# Altium schematic sheet Sheet2.SchDoc
size A4
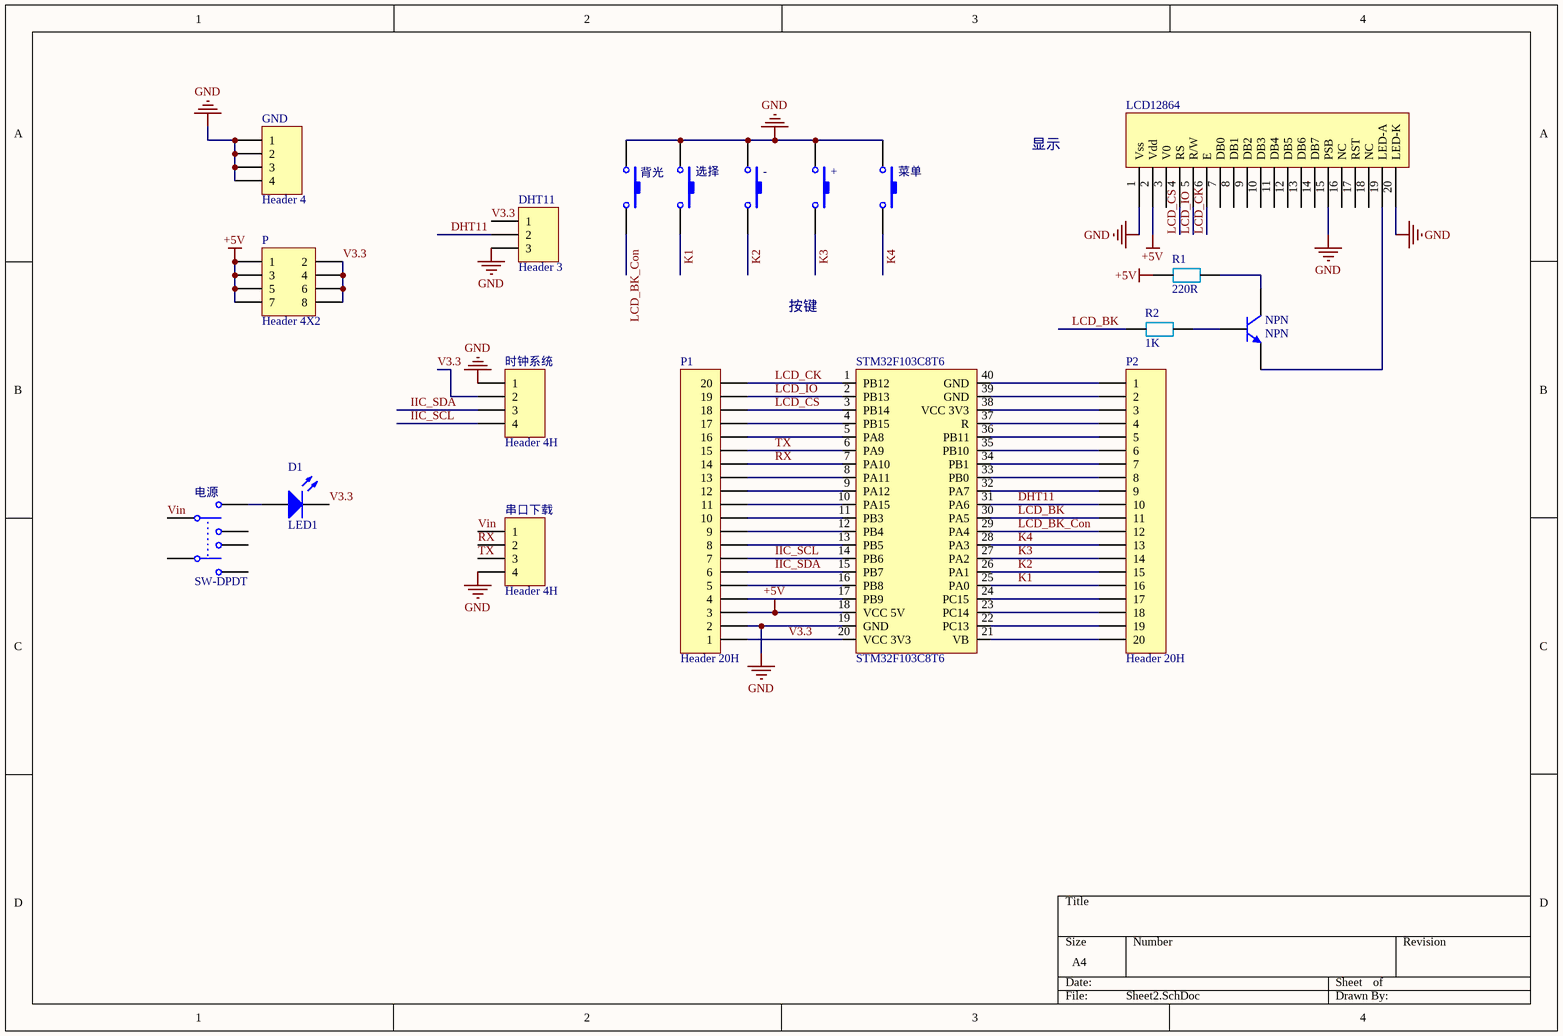
[diagram p0: Sheet2.SchDoc]

## Parts
+  SW-PB  [DPST-4]  (value not drawn)
-  SW-PB  [DPST-4]  (value not drawn)
D1  LED1  [LED-1]
DHT11  Header 3  [HDR1X3]
GND  Header 4  [HDR1X4]
LCD12864  LCD12864  [HDR1X20]  (value not drawn)
NPN  NPN  [TO-226-AA]
P  Header 4X2  [HDR2X4]
P1  Header 20H  [HDR1X20H]
P2  Header 20H  [HDR1X20H]
R1  220R  [DO-7]
R2  1K  [DO-7]
STM32F103C8T6  STM32F103C8T6  [DIP-40]
串口下载  Header 4H  [HDR1X4H]
时钟系统  Header 4H  [HDR1X4H]
电源  SW-DPDT  [DPDT-6]
背光  SW-PB  [DPST-4]  (value not drawn)
菜单  SW-PB  [DPST-4]  (value not drawn)
选择  SW-PB  [DPST-4]  (value not drawn)

## Nets
+5V: LCD12864.2(Vdd) P.1 P.3 P.5 P.7 P1.3 R1.2 STM32F103C8T6.18(VCC_5V)
GND: +.1 -.1 DHT11.3 GND.1 GND.2 GND.3 GND.4 LCD12864.1(Vss) LCD12864.15(PSB) LCD12864.20(LED-K) P1.2 STM32F103C8T6.19(GND) 串口下载.4 时钟系统.1 背光.1 菜单.1 选择.1
DHT11: DHT11.2 P2.10 STM32F103C8T6.31(PA6)
IIC_SCL: P1.7 STM32F103C8T6.14(PB6) 时钟系统.4
IIC_SDA: P1.6 STM32F103C8T6.15(PB7) 时钟系统.3
K1: P2.16 STM32F103C8T6.25(PA0) 选择.2
K2: -.2 P2.15 STM32F103C8T6.26(PA1)
K3: +.2 P2.14 STM32F103C8T6.27(PA2)
K4: P2.13 STM32F103C8T6.28(PA3) 菜单.2
LCD_BK: P2.11 R2.1 STM32F103C8T6.30(PA5)
LCD_BK_Con: P2.12 STM32F103C8T6.29(PA4) 背光.2
LCD_CK: LCD12864.6(E) P1.20 STM32F103C8T6.1(PB12)
LCD_CS: LCD12864.4(RS) P1.18 STM32F103C8T6.3(PB14)
LCD_IO: LCD12864.5(R/W) P1.19 STM32F103C8T6.2(PB13)
RX: P1.14 STM32F103C8T6.7(PA10) 串口下载.2
TX: P1.15 STM32F103C8T6.6(PA9) 串口下载.3
V3.3: D1.2(K) DHT11.1 P.2 P.4 P.6 P.8 P1.1 STM32F103C8T6.20(VCC_3V3) 时钟系统.2
Vin: 串口下载.1 电源.1
NetD1_1: D1.1(A) 电源.2
NetLCD12864_19: LCD12864.19(LED-A) NPN.3(E)
NetNPN_1: NPN.1(C) R1.1
NetNPN_2: NPN.2(B) R2.2
NetP1_4: P1.4 STM32F103C8T6.17(PB9)
NetP1_5: P1.5 STM32F103C8T6.16(PB8)
NetP1_8: P1.8 STM32F103C8T6.13(PB5)
NetP1_9: P1.9 STM32F103C8T6.12(PB4)
NetP1_10: P1.10 STM32F103C8T6.11(PB3)
NetP1_11: P1.11 STM32F103C8T6.10(PA15)
NetP1_12: P1.12 STM32F103C8T6.9(PA12)
NetP1_13: P1.13 STM32F103C8T6.8(PA11)
NetP1_16: P1.16 STM32F103C8T6.5(PA8)
NetP1_17: P1.17 STM32F103C8T6.4(PB15)
NetP2_1: P2.1 STM32F103C8T6.40(GND)
NetP2_2: P2.2 STM32F103C8T6.39(GND)
NetP2_3: P2.3 STM32F103C8T6.38(VCC_3V3)
NetP2_4: P2.4 STM32F103C8T6.37(R)
NetP2_5: P2.5 STM32F103C8T6.36(PB11)
NetP2_6: P2.6 STM32F103C8T6.35(PB10)
NetP2_7: P2.7 STM32F103C8T6.34(PB1)
NetP2_8: P2.8 STM32F103C8T6.33(PB0)
NetP2_9: P2.9 STM32F103C8T6.32(PA7)
NetP2_17: P2.17 STM32F103C8T6.24(PC15)
NetP2_18: P2.18 STM32F103C8T6.23(PC14)
NetP2_19: P2.19 STM32F103C8T6.22(PC13)
NetP2_20: P2.20 STM32F103C8T6.21(VB)

Not connected (* = marked no-connect by the designer): LCD12864 3(V0) 7(DB0) 8(DB1) 9(DB2) 10(DB3) 11(DB4) 12(DB5) 13(DB6) 14(DB7) 16(NC) 17(RST) 18(NC); 电源 3 4 5 6

## Notes on the sheet
- 显示
- 按键

## Library data of the parts
+ - 背光 菜单 选择 = SW-PB: Switch; Published: 24-Mar-1999; LatestRevisionDate: 17-Jul-2002; LatestRevisionNote: Re-released for DXP Platform.; PackageReference: SPST-2; Publisher: Altium Limited; PackageDescription: Switch; 2 Leads
D1 = LED1: Typical RED GaAs LED; Published: 8-Jun-2000; LatestRevisionDate: 08-Jul-2005; LatestRevisionNote: Mech Layer 1 removed.; PackageReference: LED-1; Publisher: Altium Limited; PackageDescription: LED; 2 Leads
DHT11 = Header 3: Header, 3-Pin; LatestRevisionDate: 17-Jul-2002; LatestRevisionNote: Re-released for DXP Platform.; Publisher: Altium Limited
GND = Header 4: Header, 4-Pin; LatestRevisionDate: 17-Jul-2002; LatestRevisionNote: Re-released for DXP Platform.; Publisher: Altium Limited
NPN = NPN: NPN Bipolar Transistor; Published: 8-Jun-2000; LatestRevisionDate: 17-Jul-2002; LatestRevisionNote: Re-released for DXP Platform.; PackageReference: TO-226-AA; Publisher: Altium Limited; PackageDescription: TO, Flat Index; 3 In-Line, Axial Leads; Body Dia. 4.8mm; Leads 0.55 x 0.51 mm (max); Code_JEDEC: TO-226-AA
P = Header 4X2: Header, 4-Pin, Dual row; LatestRevisionDate: 17-Jul-2002; LatestRevisionNote: Re-released for DXP Platform.; Publisher: Altium Limited
P1 P2 = Header 20H: Header, 20-Pin, Right Angle; LatestRevisionDate: 17-Jul-2002; LatestRevisionNote: Re-released for DXP Platform.; Publisher: Altium Limited
R1 R2 = R
串口下载 时钟系统 = Header 4H: Header, 4-Pin, Right Angle; LatestRevisionDate: 17-Jul-2002; LatestRevisionNote: Re-released for DXP Platform.; Publisher: Altium Limited
电源 = SW-DPDT: Double-Pole, Double-Throw Switch; Published: 24-Mar-1999; LatestRevisionDate: 17-Jul-2002; LatestRevisionNote: Re-released for DXP Platform.; PackageReference: DPDT-6; Publisher: Altium Limited; PackageDescription: Switch; 6 Leads